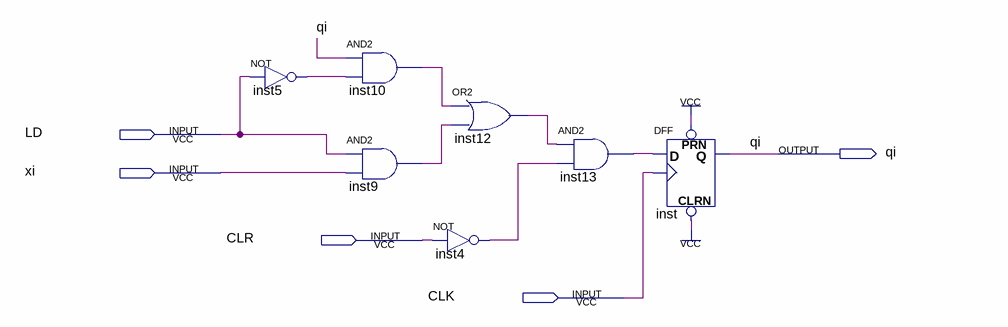
[diagram p0: schematic sheet]
// Quartus schematic registrador_1_bit.bdf as structural Verilog: 7 symbols, 5 pins
module registrador_1_bit (
  input  LD,
  input  xi,
  input  CLR,
  input  CLK,
  output qi
);

  wire inst4_out, inst5_out, inst9_out, inst10_out, inst12_out, inst13_out;

  not inst5 (inst5_out, LD);
  and inst10 (inst10_out, qi, inst5_out);
  and inst9 (inst9_out, LD, xi);
  or inst12 (inst12_out, inst10_out, inst9_out);
  not inst4 (inst4_out, CLR);
  and inst13 (inst13_out, inst12_out, inst4_out);
  DFF inst (.CLRN(1'b1), .CLK(CLK), .D(inst13_out), .PRN(1'b1), .Q(qi));
endmodule
